# Altium schematic sheet LVDS_IFC_MCX.SchDoc: DIO MCX 16 Isolated
size A3; EDA_Number: ARTIQ; Projet: ARTIQ/SINARA; Author: G.Kasprowicz; CompanyName: WUT ISE; DrawnBy: G.Kasprowicz; Organization: WUT ISE; Address1: PW ISE; Address2: Nowowiejska 15/19 00-665 Warsaw; Address3: gkasprow@gmail.com; DocumentNumber: 5; Revision: 2; SheetNumber: 5; SheetTotal: 7; ModifiedBy: -; CheckedDate: -; Title2: LVDS Interface; DivGrp: WUT ISE; Designer: G.Kasprowicz; ModifiedDate: -; ProjectName: Sensor Box
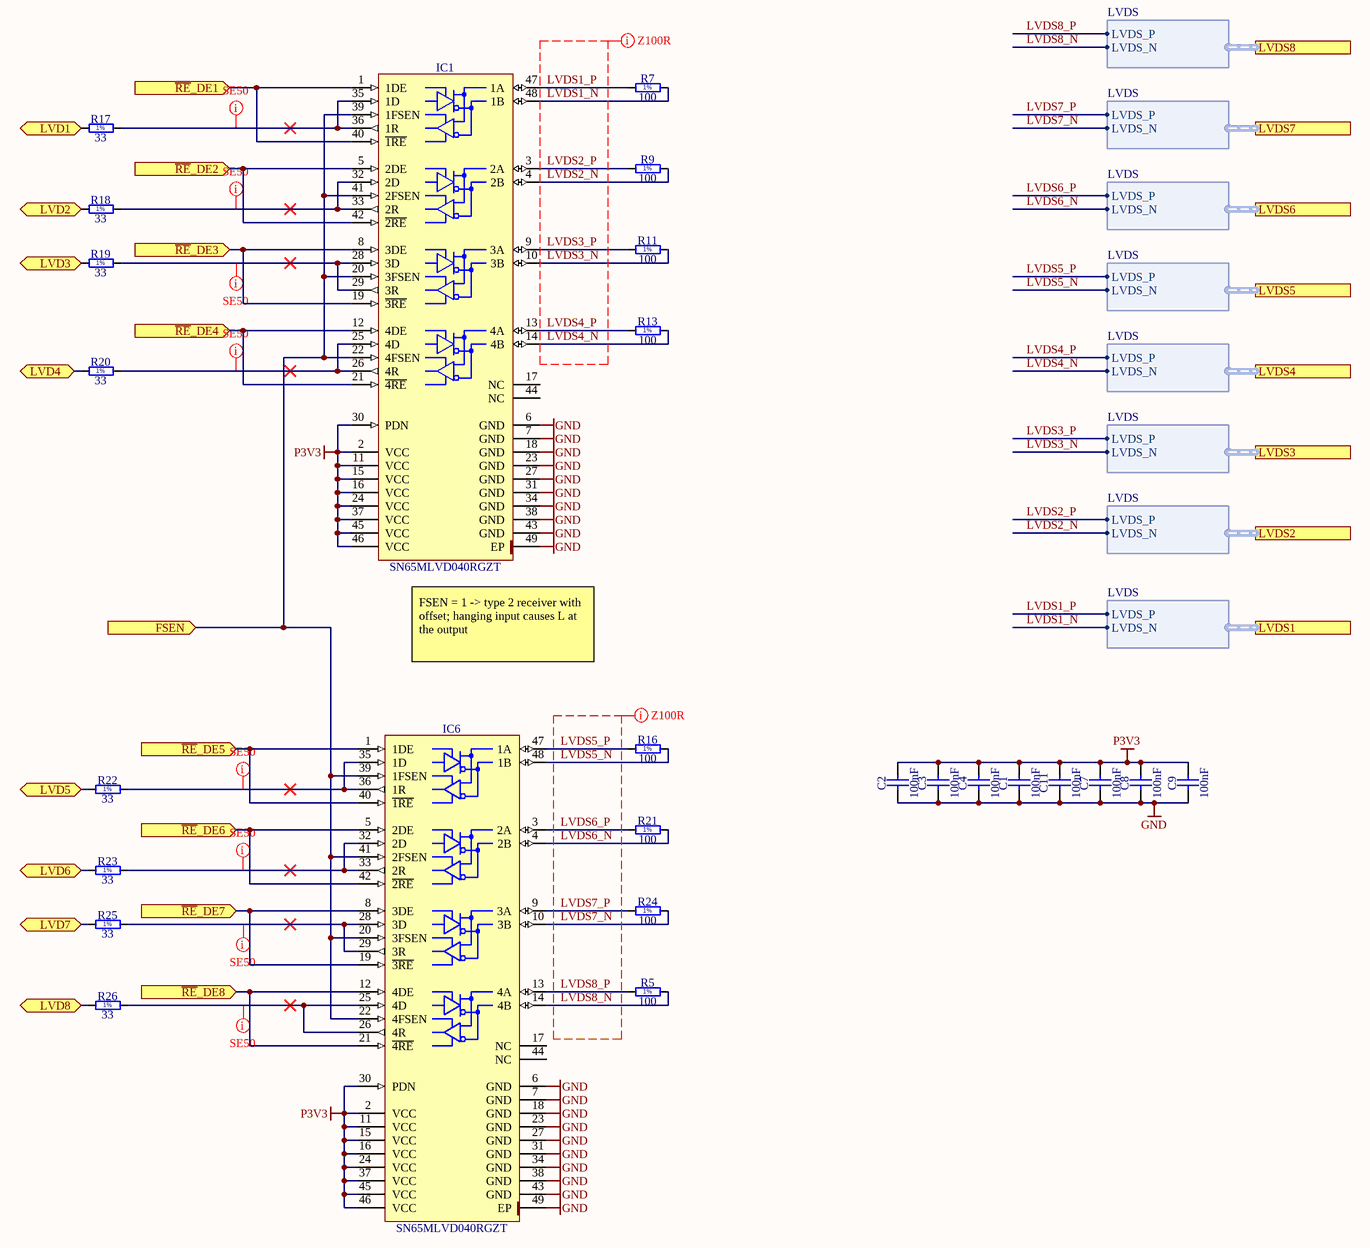
[diagram p0: LVDS_IFC_MCX.SchDoc]

## Parts
C1  100nF  [CAPC1005X55N]
C2  100nF  [CAPC1005X55N]
C3  100nF  [CAPC1005X55N]
C4  100nF  [CAPC1005X55N]
C7  100nF  [CAPC1005X55N]
C8  100nF  [CAPC1005X55N]
C9  100nF  [CAPC1005X55N]
C11  100nF  [CAPC1005X55N]
IC1  SN65MLVD040RGZT  [QFN50P700X700X100-49N-S420]
IC6  SN65MLVD040RGZT  [QFN50P700X700X100-49N-S420]
R5  100  [RESC1005X40N]
R7  100  [RESC1005X40N]
R9  100  [RESC1005X40N]
R11  100  [RESC1005X40N]
R13  100  [RESC1005X40N]
R16  100  [RESC1005X40N]
R17  33  [RESC1005X40N]
R18  33  [RESC1005X40N]
R19  33  [RESC1005X40N]
R20  33  [RESC1005X40N]
R21  100  [RESC1005X40N]
R22  33  [RESC1005X40N]
R23  33  [RESC1005X40N]
R24  100  [RESC1005X40N]
R25  33  [RESC1005X40N]
R26  33  [RESC1005X40N]

## Ports
FSEN (in), LVD1 (bidir), LVD2 (bidir), LVD3 (bidir), LVD4 (bidir), LVD5 (bidir), LVD6 (bidir), LVD7 (bidir), LVD8 (bidir), LVDS1 (harness LVDS), LVDS2 (harness LVDS), LVDS3 (harness LVDS), LVDS4 (harness LVDS), LVDS5 (harness LVDS), LVDS6 (harness LVDS), LVDS7 (harness LVDS), LVDS8 (harness LVDS), ~{RE}_DE1 (in), ~{RE}_DE2 (in), ~{RE}_DE3 (in), ~{RE}_DE4 (in), ~{RE}_DE5 (in), ~{RE}_DE6 (in), ~{RE}_DE7 (in), ~{RE}_DE8 (in)

## Harnesses
LVDS: LVDS_P, LVDS_N

## Nets
GND: C1.1 C2.1 C3.1 C4.1 C7.1 C8.1 C9.1 C11.1 IC1.6(GND) IC1.7(GND) IC1.18(GND) IC1.23(GND) IC1.27(GND) IC1.31(GND) IC1.34(GND) IC1.38(GND) IC1.43(GND) IC1.49(EP) IC6.6(GND) IC6.7(GND) IC6.18(GND) IC6.23(GND) IC6.27(GND) IC6.31(GND) IC6.34(GND) IC6.38(GND) IC6.43(GND) IC6.49(EP)
P3V3: C1.2 C2.2 C3.2 C4.2 C7.2 C8.2 C9.2 C11.2 IC1.2(VCC) IC1.11(VCC) IC1.15(VCC) IC1.16(VCC) IC1.24(VCC) IC1.30(PDN) IC1.37(VCC) IC1.45(VCC) IC1.46(VCC) IC6.2(VCC) IC6.11(VCC) IC6.15(VCC) IC6.16(VCC) IC6.24(VCC) IC6.30(PDN) IC6.37(VCC) IC6.45(VCC) IC6.46(VCC)
FSEN: IC1.20(3FSEN) IC1.22(4FSEN) IC1.39(1FSEN) IC1.41(2FSEN) IC6.20(3FSEN) IC6.22(4FSEN) IC6.39(1FSEN) IC6.41(2FSEN) ; port FSEN
LVD1: R17.1 ; port LVD1
LVD2: R18.1 ; port LVD2
LVD3: R19.1 ; port LVD3
LVD4: R20.1 ; port LVD4
LVD5: R22.1 ; port LVD5
LVD6: R23.1 ; port LVD6
LVD7: R25.1 ; port LVD7
LVD8: R26.1 ; port LVD8
LVDS1_N: IC1.48(1B) R7.2 ; port LVDS1.LVDS_N
LVDS1_P: IC1.47(1A) R7.1 ; port LVDS1.LVDS_P
LVDS2_N: IC1.4(2B) R9.2 ; port LVDS2.LVDS_N
LVDS2_P: IC1.3(2A) R9.1 ; port LVDS2.LVDS_P
LVDS3_N: IC1.10(3B) R11.2 ; port LVDS3.LVDS_N
LVDS3_P: IC1.9(3A) R11.1 ; port LVDS3.LVDS_P
LVDS4_N: IC1.14(4B) R13.2 ; port LVDS4.LVDS_N
LVDS4_P: IC1.13(4A) R13.1 ; port LVDS4.LVDS_P
LVDS5_N: IC6.48(1B) R16.2 ; port LVDS5.LVDS_N
LVDS5_P: IC6.47(1A) R16.1 ; port LVDS5.LVDS_P
LVDS6_N: IC6.4(2B) R21.2 ; port LVDS6.LVDS_N
LVDS6_P: IC6.3(2A) R21.1 ; port LVDS6.LVDS_P
LVDS7_N: IC6.10(3B) R24.2 ; port LVDS7.LVDS_N
LVDS7_P: IC6.9(3A) R24.1 ; port LVDS7.LVDS_P
LVDS8_N: IC6.14(4B) R5.2 ; port LVDS8.LVDS_N
LVDS8_P: IC6.13(4A) R5.1 ; port LVDS8.LVDS_P
~{RE}_DE1: IC1.1(1DE) IC1.40(~{1RE}) ; port ~{RE}_DE1
~{RE}_DE2: IC1.5(2DE) IC1.42(~{2RE}) ; port ~{RE}_DE2
~{RE}_DE3: IC1.8(3DE) IC1.19(~{3RE}) ; port ~{RE}_DE3
~{RE}_DE4: IC1.12(4DE) IC1.21(~{4RE}) ; port ~{RE}_DE4
~{RE}_DE5: IC6.1(1DE) IC6.40(~{1RE}) ; port ~{RE}_DE5
~{RE}_DE6: IC6.5(2DE) IC6.42(~{2RE}) ; port ~{RE}_DE6
~{RE}_DE7: IC6.8(3DE) IC6.19(~{3RE}) ; port ~{RE}_DE7
~{RE}_DE8: IC6.12(4DE) IC6.21(~{4RE}) ; port ~{RE}_DE8
NetIC1_25: IC1.25(4D) IC1.26(4R) R20.2
NetIC1_28: IC1.28(3D) IC1.29(3R) R19.2
NetIC1_32: IC1.32(2D) IC1.33(2R) R18.2
NetIC1_35: IC1.35(1D) IC1.36(1R) R17.2
NetIC6_25: IC6.25(4D) IC6.26(4R) R26.2
NetIC6_28: IC6.28(3D) IC6.29(3R) R25.2
NetIC6_32: IC6.32(2D) IC6.33(2R) R23.2
NetIC6_35: IC6.35(1D) IC6.36(1R) R22.2

Not connected (* = marked no-connect by the designer): IC1 17(NC) 44(NC); IC6 17(NC) 44(NC)

## Layout directives
net class Z100R: LVDS1_N, LVDS1_P, LVDS2_N, LVDS2_P, LVDS3_N, LVDS3_P, LVDS4_N, LVDS4_P, LVDS5_N, LVDS5_P, LVDS6_N, LVDS6_P, LVDS7_N, LVDS7_P, LVDS8_N, LVDS8_P
net class SE50; rule Width Constraint [Pref Width = 0.35mm    Min Width = 0.3mm    Max Width = 0.35mm]: NetIC1_25, NetIC1_28, NetIC1_32, NetIC1_35, NetIC6_25, NetIC6_28, NetIC6_32, NetIC6_35

## Notes on the sheet
- (near IC1) FSEN = 1 -> type 2 receiver with offset; hanging input causes L at the output
- ARTIQ
- Project
- Name
- Copyright WUT ISE 2020.
  This document describes Open Hardware and is licensed under the CERN-OHL-S v2
  You may redistribute and modify this documentation and make products using it under the terms of the CERN-OHL-S v2 (https:/cern.ch/cern-ohl). This documentation is distributed WITHOUT ANY EXPRESS OR IMPLIED WARRANTY, INCLUDING OF MERCHANTABILITY, SATISFACTORY QUALITY AND FITNESS FOR A PARTICULAR PURPOSE. Please see the CERN-OHL-S v2 for applicable conditions.
  As per CERN-OHL-S v2 section 4, should You produce hardware based on these sources, You must maintain the Source Location visible on the silkscreen or top copper for a DI/OT System Board PCB or other product you make using this documentation.
- Sheet
- 2020
- Size
- A3
- of
- Rev
- -------------------------------
- 1.0
- (in symbol R0402_33R_1%_0.0625W_100PPM) 1%
- (in symbol R0402_100R_1%_0.1W_100PPM) 1%

## Library data of the parts
C1-C4 C7-C9 C11 = CC0402_100NF_16V_10%_X5R: Non-polarised capacitor; Part Description: SMD Multilayer Chip Ceramic Capacitor; Manufacturer: GENERIC; Manufacturer1 Part Number: GRM155R61C104KA88D; Voltage: 16V; TC: X5R; Tolerance: ±10%; Part Number: CC0402_100NF_16V_10%_X5R; Component Kind: Standard; Component Type: Standard; Pin Count: 2; Value: 100nF; Status: None; Manufacturer Part Number: CC0402_100NF_16V_10%_X5R; Case: 0402; Mounted: Yes; Socket: No; SMD: Yes; Sense: No; Manufacturer1 Example: MURATA; Manufacturer1 ComponentHeight: 0.55mm; HelpURL: \\cern.ch\dfs\Applications\Altium\Datasheets\CC0402_X5R_MURATA_GRM.pdf; Author: CERN DEM JLC; CreateDate: 10.12.2013; LatestRevisionDate: 10.12.2013
IC1 IC6 = SN65MLVD040RGZT: 4-Channel Half-Duplex M-LVDS Line Transceiver; Manufacturer: TEXAS INSTRUMENTS; PressFit: No; Bonding: No; Part Number: SN65MLVD040RGZT; Component Kind: Standard; Component Type: Standard; Device: SN65MLVD040RGZT; PackageDescription: QFN, 0.50mm Pitch, Square; 48 Pin, 7.00mm L X 7.00mm W X 1mm H body (W/Thermal Tab 4.2mm X 4.2mm), IPC Medium Density; Part Description: 4-Channel Half-Duplex M-LVDS Line Transceiver; Manufacturer Part Number: SN65MLVD040RGZT; Pin Count: 49; Case: QFN48; Mounted: Yes; Socket: No; SMD: Yes; Sense: No; ComponentHeight: 1mm; Author: CERN DEM JLC; HelpURL: \\cern.ch\dfs\Applications\Altium\Datasheets\SN65MLVD040RGZT.pdf; CreateDate: 17.03.2011; LatestRevisionDate: 17.03.2011
R5 R7 R9 R11 R13 R16 R21 R24 = R0402_100R_1%_0.1W_100PPM: Resistor - 1%; Part Description: General Purpose Thick Film Chip Resistor; Manufacturer: GENERIC; Manufacturer Part Number: R0402_100R_1%_0.1W_100PPM_50V; Manufacturer1 Part Number: ERJ2RKF1000X; Power: 0.1W; TC: ±100ppm/°C; Voltage: 50V; Part Number: R0402_100R_1%_0.1W_100PPM; Component Kind: Standard; Component Type: Standard; Pin Count: 2; Value: 100; Status: Not recommended; Tolerance: ±1%; Case: 0402; Mounted: Yes; Sense: No; Socket: No; SMD: Yes; Manufacturer1 Example: PANASONIC; Manufacturer1 ComponentHeight: 0.4mm; HelpURL: \\cern.ch\dfs\Applications\Altium\Datasheets\R0402_PANASONIC_ERJ2RK.pdf; Author: CERN DEM JLC; CreateDate: 12.12.2013; LatestRevisionDate: 03.03.2015
R17-R20 R22 R23 R25 R26 = R0402_33R_1%_0.0625W_100PPM: Resistor - 1%; Part Description: General Purpose Thick Film Chip Resistor; Manufacturer: GENERIC; Manufacturer1 Part Number: 232270673309L; TC: ±100ppm/°C; PressFit: No; Part Number: R0402_33R_1%_0.0625W_100PPM; Component Kind: Standard; Component Type: Standard; Pin Count: 2; Value: 33; Status: Not Recommended; Power: 0.0625W; Tolerance: ±1%; Manufacturer Part Number: R0402_33R_1%_0.0625W_100PPM; Case: 0402; Mounted: Yes; Sense: No; Socket: No; SMD: Yes; Manufacturer1 Example: YAGEO PHYCOMP; Manufacturer1 ComponentHeight: 0.4mm; HelpURL: \\cern.ch\dfs\Applications\Altium\Datasheets\R0402_Phycomp_RC0402.pdf; Author: CERN DEM JLC; CreateDate: 03.12.2007; LatestRevisionDate: 17.10.2012